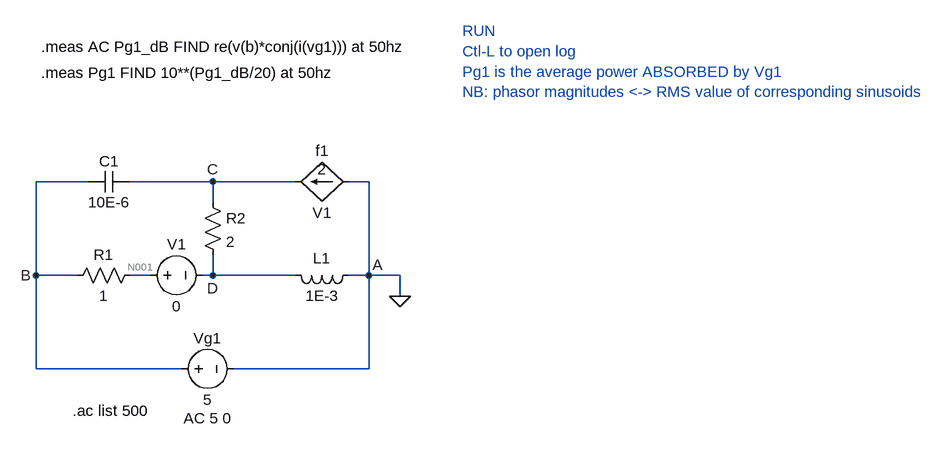
[diagram p0: schematic ac_analysis.asc]
ac_analysis.asc, the LTspice schematic file:
Version 4
SHEET 1 1304 680
WIRE -48 -80 -128 -80
WIRE 144 -80 16 -80
WIRE 272 -80 144 -80
WIRE 384 -80 352 -80
WIRE 144 -48 144 -80
WIRE -128 64 -128 -80
WIRE -64 64 -128 64
WIRE 48 64 16 64
WIRE 144 64 144 32
WIRE 144 64 128 64
WIRE 272 64 144 64
WIRE 384 64 384 -80
WIRE 384 64 352 64
WIRE 432 64 384 64
WIRE 432 96 432 64
WIRE -128 208 -128 64
WIRE 96 208 -128 208
WIRE 384 208 384 64
WIRE 384 208 176 208
FLAG 432 96 0
FLAG -128 64 B
FLAG 144 -80 C
FLAG 144 64 D
FLAG 384 64 A
SYMBOL voltage 80 208 R270
WINDOW 0 32 56 VTop 2
WINDOW 3 -32 56 VBottom 2
WINDOW 123 -60 56 VBottom 2
WINDOW 39 0 0 Left 0
SYMATTR InstName Vg1
SYMATTR Value 5
SYMATTR Value2 AC 5 0
SYMBOL res 32 48 R90
WINDOW 0 0 56 VBottom 2
WINDOW 3 32 56 VTop 2
SYMATTR InstName R1
SYMATTR Value 1
SYMBOL cap 16 -96 R90
WINDOW 0 0 32 VBottom 2
WINDOW 3 32 32 VTop 2
SYMATTR InstName C1
SYMATTR Value 10E-6
SYMBOL res 128 -64 R0
SYMATTR InstName R2
SYMATTR Value 2
SYMBOL ind 368 48 R90
WINDOW 0 5 56 VBottom 2
WINDOW 3 32 56 VTop 2
SYMATTR InstName L1
SYMATTR Value 1E-3
SYMBOL f 352 -80 R90
WINDOW 0 -32 40 VBottom 2
WINDOW 3 32 40 VTop 2
WINDOW 123 -4 40 VBottom 2
SYMATTR InstName f1
SYMATTR Value V1
SYMATTR Value2 2
SYMBOL voltage 32 64 R270
WINDOW 0 32 56 VTop 2
WINDOW 3 -32 56 VBottom 2
SYMATTR InstName V1
SYMATTR Value 0
TEXT -72 272 Left 2 !.ac list 500
TEXT -120 -288 Left 2 !.meas AC Pg1_dB FIND re(v(b)*conj(i(vg1))) at 50hz
TEXT -120 -248 Left 2 !.meas Pg1 FIND 10**(Pg1_dB/20) at 50hz
TEXT 528 -312 Left 2 ;RUN\nCtl-L to open log\nPg1 is the average power ABSORBED by Vg1\nNB: phasor magnitudes <-> RMS value of corresponding sinusoids

The netlist it stands for:
* ac_analysis.asc
Vg1 B 0 5 AC 5 0
R1 N001 B 1
C1 C B 10E-6
R2 C D 2
L1 0 D 1E-3
f1 0 C V1 2
V1 N001 D 0
.ac list 500
.meas AC Pg1_dB FIND re(v(b)*conj(i(vg1))) at 50hz
.meas Pg1 FIND 10**(Pg1_dB/20) at 50hz
* RUN
* Ctl-L to open log
* Pg1 is the average power ABSORBED by Vg1
* NB: phasor magnitudes <-> RMS value of corresponding sinusoids
.backanno
.end

* Results of the author's LTspice run, read from the files saved beside the schematic
* AC Analysis:
*   frequency = 500 
*   V(b) = 5 V
*   V(n001) = 4.928 V
*   V(c) = 5.117 V
*   V(d) = 4.928 V
*   I(C1) = 49.39 mA
*   I(F1) = 144 mA
*   I(L1) = -166.5 mA
*   I(R2) = 94.56 mA
*   I(R1) = -71.98 mA
*   I(V1) = 71.98 mA
*   I(Vg1) = -22.58 mA
* From the log:
*   pg1_db: re(v(b)*conj(i(vg1)))=(-18.9445dB,180°) at 50
*   pg1: 10**(pg1_db/20)=(-0.112921dB,0°) at 50